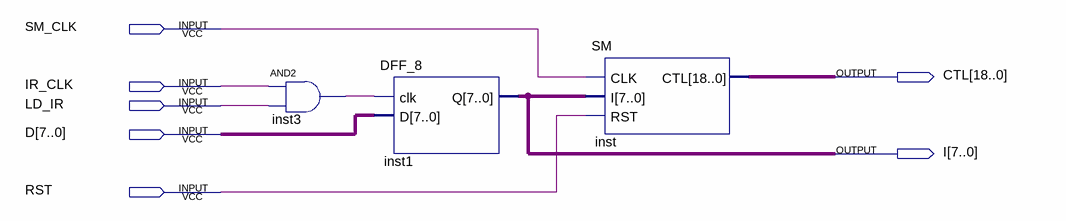
[diagram p0: schematic sheet]
// Quartus schematic CTL.bdf as structural Verilog: 3 symbols, 7 pins
module CTL (
  input  SM_CLK,
  input  IR_CLK,
  input  LD_IR,
  input  [7:0] D,
  input  RST,
  output [18:0] CTL,
  output [7:0] I
);

  wire inst3_out;

  and inst3 (inst3_out, IR_CLK, LD_IR);
  DFF_8 inst1 (.clk(inst3_out), .D(D), .Q(I));
  SM inst (.CLK(SM_CLK), .I(I), .RST(RST), .CTL(CTL));
endmodule
